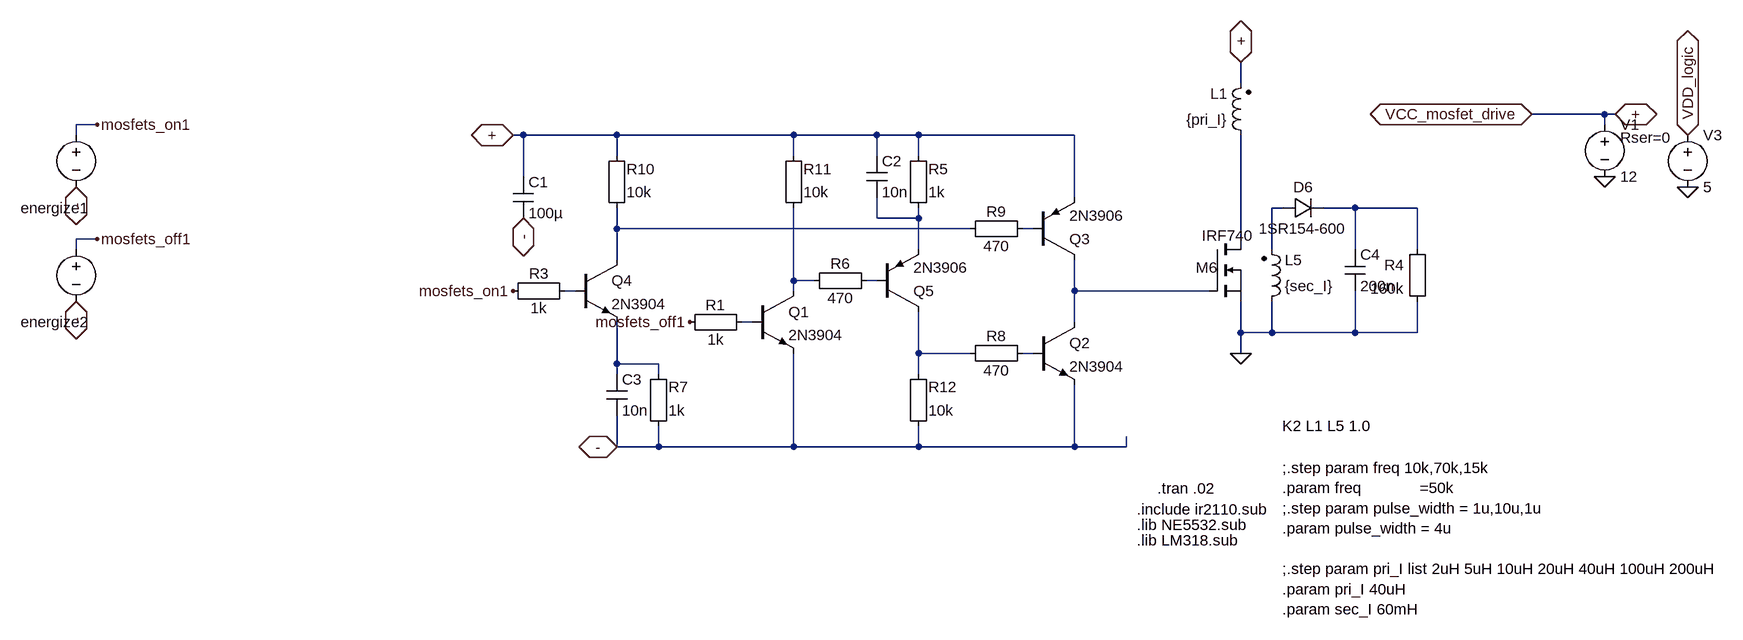
[diagram p0: schematic metal_SMPS_400v_1.asc]
metal_SMPS_400v_1.asc, the LTspice schematic file:
Version 4
SHEET 1 6068 1612
WIRE 3344 -2608 3344 -2640
WIRE 3904 -2560 3792 -2560
WIRE 3920 -2560 3904 -2560
WIRE 1584 -2544 1552 -2544
WIRE 3904 -2544 3904 -2560
WIRE 1552 -2528 1552 -2544
WIRE 2240 -2528 2224 -2528
WIRE 2384 -2528 2240 -2528
WIRE 2656 -2528 2384 -2528
WIRE 2784 -2528 2656 -2528
WIRE 2848 -2528 2784 -2528
WIRE 3088 -2528 2848 -2528
WIRE 2384 -2496 2384 -2528
WIRE 2656 -2496 2656 -2528
WIRE 2784 -2496 2784 -2528
WIRE 2848 -2496 2848 -2528
WIRE 2240 -2464 2240 -2528
WIRE 3088 -2432 3088 -2528
WIRE 3408 -2416 3392 -2416
WIRE 3520 -2416 3472 -2416
WIRE 3616 -2416 3520 -2416
WIRE 2784 -2400 2784 -2432
WIRE 2848 -2400 2848 -2416
WIRE 2848 -2400 2784 -2400
WIRE 2384 -2384 2384 -2416
WIRE 2928 -2384 2384 -2384
WIRE 3024 -2384 3008 -2384
WIRE 1584 -2368 1552 -2368
WIRE 3344 -2368 3344 -2528
WIRE 1552 -2352 1552 -2368
WIRE 2848 -2352 2848 -2400
WIRE 3392 -2352 3392 -2416
WIRE 3520 -2352 3520 -2416
WIRE 3616 -2352 3616 -2416
WIRE 2384 -2336 2384 -2384
WIRE 2656 -2304 2656 -2416
WIRE 2688 -2304 2656 -2304
WIRE 2784 -2304 2768 -2304
WIRE 2320 -2288 2304 -2288
WIRE 2656 -2288 2656 -2304
WIRE 3088 -2288 3088 -2336
WIRE 3296 -2288 3088 -2288
WIRE 2592 -2240 2576 -2240
WIRE 3088 -2240 3088 -2288
WIRE 3344 -2224 3344 -2272
WIRE 3392 -2224 3392 -2272
WIRE 3392 -2224 3344 -2224
WIRE 3520 -2224 3520 -2288
WIRE 3520 -2224 3392 -2224
WIRE 3616 -2224 3616 -2272
WIRE 3616 -2224 3520 -2224
WIRE 2848 -2192 2848 -2256
WIRE 2928 -2192 2848 -2192
WIRE 3024 -2192 3008 -2192
WIRE 3344 -2192 3344 -2224
WIRE 2384 -2176 2384 -2240
WIRE 2448 -2176 2384 -2176
WIRE 2384 -2160 2384 -2176
WIRE 2448 -2160 2448 -2176
WIRE 2848 -2160 2848 -2192
WIRE 2384 -2048 2384 -2096
WIRE 2448 -2048 2448 -2080
WIRE 2448 -2048 2384 -2048
WIRE 2656 -2048 2656 -2192
WIRE 2656 -2048 2448 -2048
WIRE 2848 -2048 2848 -2080
WIRE 2848 -2048 2656 -2048
WIRE 3088 -2048 3088 -2144
WIRE 3088 -2048 2848 -2048
WIRE 3168 -2048 3168 -2064
WIRE 3168 -2048 3088 -2048
FLAG 3344 -2192 0
FLAG 3792 -2560 VCC_mosfet_drive
IOPIN 3792 -2560 BiDir
FLAG 4032 -2448 0
FLAG 4032 -2528 VDD_logic
IOPIN 4032 -2528 BiDir
FLAG 3920 -2560 +
IOPIN 3920 -2560 BiDir
FLAG 3904 -2464 0
FLAG 3344 -2640 +
IOPIN 3344 -2640 BiDir
FLAG 1552 -2448 -
IOPIN 1552 -2448 BiDir
FLAG 1584 -2544 mosfets_on1
FLAG 1552 -2272 -
IOPIN 1552 -2272 BiDir
FLAG 1584 -2368 mosfets_off1
FLAG 2240 -2400 -
IOPIN 2240 -2400 BiDir
FLAG 2384 -2048 -
IOPIN 2384 -2048 BiDir
FLAG 2224 -2288 mosfets_on1
FLAG 2496 -2240 mosfets_off1
FLAG 2224 -2528 +
IOPIN 2224 -2528 BiDir
SYMBOL ind2 3376 -2256 M180
WINDOW 0 36 80 Left 2
WINDOW 3 36 40 Left 2
SYMATTR InstName L5
SYMATTR Value {sec_I}
SYMATTR SpiceLine Rser=.42
SYMATTR Type ind
SYMBOL diode 3408 -2400 R270
WINDOW 0 32 32 VTop 2
WINDOW 3 0 32 VBottom 2
SYMATTR InstName D6
SYMATTR Value 1SR154-600
SYMBOL Misc\\EuropeanCap 3504 -2352 R0
SYMATTR InstName C4
SYMATTR Value 200n
SYMBOL Misc\\EuropeanResistor 3632 -2368 M0
SYMATTR InstName R4
SYMATTR Value 160k
SYMBOL nmos 3296 -2368 R0
WINDOW 0 -21 44 Left 2
WINDOW 3 -12 -5 Left 2
SYMATTR InstName M6
SYMATTR Value IRF740
SYMBOL ind2 3360 -2512 R180
WINDOW 0 36 80 Left 2
WINDOW 3 36 40 Left 2
SYMATTR InstName L1
SYMATTR Value {pri_I}
SYMATTR SpiceLine Rser=.0003
SYMATTR Type ind
SYMBOL voltage 4032 -2544 R0
WINDOW 123 0 0 Left 2
SYMATTR SpiceLine Rser=20
SYMATTR InstName V3
SYMATTR Value 5
SYMBOL voltage 3904 -2560 R0
WINDOW 123 0 0 Left 2
WINDOW 39 24 36 Left 2
SYMATTR SpiceLine Rser=0
SYMATTR InstName V1
SYMATTR Value 12
SYMBOL Misc\\EuropeanCap 2224 -2464 R0
SYMATTR InstName C1
SYMATTR Value 100µ
SYMATTR SpiceLine V=400 Irms=1 Rser=.32 Lser=0
SYMBOL npn3 2592 -2288 R0
SYMATTR InstName Q1
SYMATTR Value 2N3904
SYMBOL Misc\\EuropeanResistor 2480 -2256 M90
WINDOW 0 5 56 VBottom 2
WINDOW 3 27 56 VTop 2
SYMATTR InstName R1
SYMATTR Value 1k
SYMBOL npn3 3024 -2240 R0
SYMATTR InstName Q2
SYMATTR Value 2N3904
SYMBOL pnp2 3024 -2336 M180
SYMATTR InstName Q3
SYMATTR Value 2N3906
SYMBOL npn3 2320 -2336 R0
SYMATTR InstName Q4
SYMATTR Value 2N3904
SYMBOL Misc\\EuropeanResistor 2208 -2304 M90
WINDOW 0 5 56 VBottom 2
WINDOW 3 27 56 VTop 2
SYMATTR InstName R3
SYMATTR Value 1k
SYMBOL pnp2 2784 -2256 M180
SYMATTR InstName Q5
SYMATTR Value 2N3906
SYMBOL Misc\\EuropeanResistor 2832 -2400 M180
WINDOW 0 31 76 Left 2
WINDOW 3 31 40 Left 2
SYMATTR InstName R5
SYMATTR Value 1k
SYMBOL Misc\\EuropeanResistor 2672 -2320 M90
WINDOW 0 5 56 VBottom 2
WINDOW 3 27 56 VTop 2
SYMATTR InstName R6
SYMATTR Value 470
SYMBOL Misc\\EuropeanCap 2768 -2496 R0
SYMATTR InstName C2
SYMATTR Value 10n
SYMATTR SpiceLine V=400 Irms=1 Rser=.32 Lser=0
SYMBOL Misc\\EuropeanResistor 2432 -2064 M180
WINDOW 0 31 76 Left 2
WINDOW 3 31 40 Left 2
SYMATTR InstName R7
SYMATTR Value 1k
SYMBOL Misc\\EuropeanCap 2368 -2160 R0
SYMATTR InstName C3
SYMATTR Value 10n
SYMATTR SpiceLine V=400 Irms=1 Rser=.32 Lser=0
SYMBOL Misc\\EuropeanResistor 3024 -2176 M270
WINDOW 0 27 56 VTop 2
WINDOW 3 5 56 VBottom 2
SYMATTR InstName R8
SYMATTR Value 470
SYMBOL Misc\\EuropeanResistor 2912 -2400 M90
WINDOW 0 5 56 VBottom 2
WINDOW 3 27 56 VTop 2
SYMATTR InstName R9
SYMATTR Value 470
SYMBOL Misc\\EuropeanResistor 2368 -2400 M180
WINDOW 0 31 76 Left 2
WINDOW 3 31 40 Left 2
SYMATTR InstName R10
SYMATTR Value 10k
SYMBOL Misc\\EuropeanResistor 2640 -2400 M180
WINDOW 0 31 76 Left 2
WINDOW 3 31 40 Left 2
SYMATTR InstName R11
SYMATTR Value 10k
SYMBOL Misc\\EuropeanResistor 2832 -2064 M180
WINDOW 0 31 76 Left 2
WINDOW 3 31 40 Left 2
SYMATTR InstName R12
SYMATTR Value 10k
SYMBOL voltage 1552 -2368 M0
WINDOW 0 -21 128 Left 2
WINDOW 3 -134 119 Invisible 2
WINDOW 123 0 0 Left 2
SYMATTR InstName energize2
SYMATTR Value PULSE(0 4.8 {pulse_width} 1e-7 1e-7 2e-7 {1/freq})
SYMATTR SpiceLine Rser=0
SYMBOL voltage 1552 -2544 M0
WINDOW 0 -21 128 Left 2
WINDOW 3 -134 119 Invisible 2
WINDOW 123 0 0 Left 2
SYMATTR InstName energize1
SYMATTR Value PULSE(0 4.8 0 1e-7 1e-7 2e-7 {1/freq})
SYMATTR SpiceLine Rser=0
TEXT 3408 -2016 Left 2 !;.step param freq 10k,70k,15k\n.param freq             =50k\n;.step param pulse_width = 1u,10u,1u\n.param pulse_width = 4u\n \n;.step param pri_I list 2uH 5uH 10uH 20uH 40uH 100uH 200uH\n.param pri_I 40uH\n.param sec_I 60mH
TEXT 3184 -1928 Left 2 !.lib NE5532.sub
TEXT 3184 -1904 Left 2 !.lib LM318.sub
TEXT 3184 -1952 Left 2 !.include ir2110.sub
TEXT 3216 -1984 Left 2 !.tran .02
TEXT 3408 -2080 Left 2 !K2 L1 L5 1.0

The netlist it stands for:
* metal_SMPS_400v_1.asc
L5 0 N001 {sec_I} Rser=.42
D6 N001 N002 1SR154-600
C4 N002 0 200n
R4 N002 0 160k
M6 N006 N010 0 0 IRF740
L1 N006 + {pri_I} Rser=.0003
V3 VDD_logic 0 5 Rser=20
V1 + 0 12 Rser=0
C1 + - 100µ V=400 Irms=1 Rser=.32 Lser=0
Q1 N007 N011 - 0 2N3904
R1 mosfets_off1 N011 1k
Q2 N010 N013 - 0 2N3904
Q3 N010 N005 + 0 2N3906
Q4 N004 N009 N014 0 2N3904
R3 mosfets_on1 N009 1k
Q5 N012 N008 N003 0 2N3906
R5 N003 + 1k
R6 N007 N008 470
C2 + N003 10n V=400 Irms=1 Rser=.32 Lser=0
R7 - N014 1k
C3 N014 - 10n V=400 Irms=1 Rser=.32 Lser=0
R8 N013 N012 470
R9 N004 N005 470
R10 N004 + 10k
R11 N007 + 10k
R12 - N012 10k
V§energize2 mosfets_off1 - PULSE(0 4.8 {pulse_width} 1e-7 1e-7 2e-7 {1/freq}) Rser=0
V§energize1 mosfets_on1 - PULSE(0 4.8 0 1e-7 1e-7 2e-7 {1/freq}) Rser=0
.model D D
.lib standard.dio
.model NPN NPN
.model PNP PNP
.lib standard.bjt
.model NMOS NMOS
.model PMOS PMOS
.lib standard.mos
;.step param freq 10k,70k,15k
.param freq             =50k
;.step param pulse_width = 1u,10u,1u
.param pulse_width = 4u
;.step param pri_I list 2uH 5uH 10uH 20uH 40uH 100uH 200uH
.param pri_I 40uH
.param sec_I 60mH
.lib NE5532.sub
.lib LM318.sub
.include ir2110.sub
.tran .02
K2 L1 L5 1.0
.backanno
.end